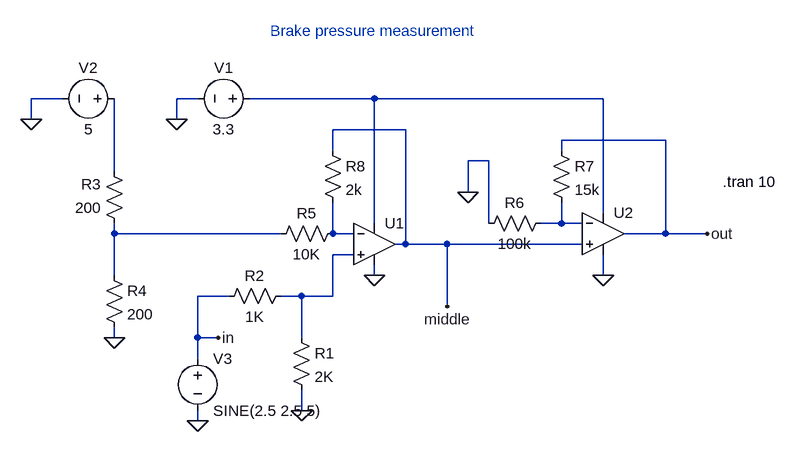
[diagram p0: schematic Brake pressure.asc]
Brake pressure.asc, the LTspice schematic file:
Version 4
SHEET 1 880 680
WIRE -320 -48 -368 -48
WIRE -112 -48 -144 -48
WIRE 160 -48 -32 -48
WIRE 512 -48 160 -48
WIRE -368 -16 -368 -48
WIRE -144 -16 -144 -48
WIRE 208 0 96 0
WIRE 608 16 448 16
WIRE 96 32 96 0
WIRE 448 32 448 16
WIRE 336 48 304 48
WIRE -240 64 -240 -48
WIRE 304 96 304 48
WIRE 512 128 512 -48
WIRE 160 144 160 -48
WIRE 336 144 336 48
WIRE 448 144 448 112
WIRE 448 144 416 144
WIRE 480 144 448 144
WIRE -240 160 -240 144
WIRE 16 160 -240 160
WIRE 96 160 96 112
WIRE 128 160 96 160
WIRE 608 160 608 16
WIRE 608 160 544 160
WIRE 672 160 608 160
WIRE 208 176 208 0
WIRE 208 176 192 176
WIRE 272 176 208 176
WIRE 480 176 272 176
WIRE 128 192 96 192
WIRE -240 224 -240 160
WIRE 160 224 160 208
WIRE 512 224 512 192
WIRE -64 256 -112 256
WIRE 48 256 16 256
WIRE 96 256 96 192
WIRE 96 256 48 256
WIRE 272 272 272 176
WIRE -240 320 -240 304
WIRE -112 320 -112 256
WIRE -80 320 -112 320
WIRE 48 320 48 256
WIRE -112 352 -112 320
WIRE 48 432 48 400
WIRE -112 448 -112 432
FLAG -240 320 0
FLAG 304 96 0
FLAG 48 432 0
FLAG 512 224 0
FLAG 160 224 0
FLAG -144 -16 0
FLAG -368 -16 0
FLAG -112 448 0
FLAG -80 320 in
FLAG 672 160 out
FLAG 272 272 middle
SYMBOL OpAmps\\UniversalOpamp 160 176 R0
SYMATTR InstName U1
SYMBOL OpAmps\\UniversalOpamp 512 160 R0
SYMATTR InstName U2
SYMBOL res 32 304 R0
SYMATTR InstName R1
SYMATTR Value 2K
SYMATTR SpiceLine tol=1 pwr=0.1
SYMBOL res 32 240 R90
WINDOW 0 0 56 VBottom 2
WINDOW 3 32 56 VTop 2
SYMATTR InstName R2
SYMATTR Value 1K
SYMATTR SpiceLine tol=1 pwr=0.1
SYMBOL res -224 160 R180
WINDOW 0 36 76 Left 2
WINDOW 3 36 40 Left 2
SYMATTR InstName R3
SYMATTR Value 200
SYMATTR SpiceLine tol=1 pwr=0.1
SYMBOL res -256 208 R0
SYMATTR InstName R4
SYMATTR Value 200
SYMATTR SpiceLine tol=1 pwr=0.1
SYMBOL res 112 144 R90
WINDOW 0 0 56 VBottom 2
WINDOW 3 32 56 VTop 2
SYMATTR InstName R5
SYMATTR Value 10K
SYMATTR SpiceLine tol=1 pwr=0.1
SYMBOL res 432 128 R90
WINDOW 0 0 56 VBottom 2
WINDOW 3 32 56 VTop 2
SYMATTR InstName R6
SYMATTR Value 100k
SYMATTR SpiceLine tol=1 pwr=0.1
SYMBOL voltage -16 -48 R90
WINDOW 0 -32 56 VBottom 2
WINDOW 3 32 56 VTop 2
WINDOW 123 0 0 Left 0
WINDOW 39 0 0 Left 0
SYMATTR InstName V1
SYMATTR Value 3.3
SYMBOL voltage -224 -48 R90
WINDOW 0 -32 56 VBottom 2
WINDOW 3 32 56 VTop 2
WINDOW 123 0 0 Left 0
WINDOW 39 0 0 Left 0
SYMATTR InstName V2
SYMATTR Value 5
SYMBOL voltage -112 336 R0
WINDOW 123 0 0 Left 0
WINDOW 39 0 0 Left 0
SYMATTR InstName V3
SYMATTR Value SINE(2.5 2.5 5)
SYMBOL res 80 16 R0
SYMATTR InstName R8
SYMATTR Value 2k
SYMBOL res 432 16 R0
SYMATTR InstName R7
SYMATTR Value 15k
TEXT 696 80 Left 2 !.tran 10
TEXT 0 -152 Left 2 ;Brake pressure measurement

The netlist it stands for:
* Brake pressure.asc
XU1 N006 N005 N001 0 middle level1 Avol=1Meg GBW=10Meg Vos=0 En=0 Enk=0 In=0 Ink=0 Rin=500Meg  ; pins In+ In- V+ V- OUT
XU2 middle N003 N001 0 out level1 Avol=1Meg GBW=10Meg Vos=0 En=0 Enk=0 In=0 Ink=0 Rin=500Meg  ; pins In+ In- V+ V- OUT
R1 N006 0 2K tol=1 pwr=0.1
R2 N006 in 1K tol=1 pwr=0.1
R3 N004 N002 200 tol=1 pwr=0.1
R4 N004 0 200 tol=1 pwr=0.1
R5 N005 N004 10K tol=1 pwr=0.1
R6 N003 0 100k tol=1 pwr=0.1
V1 N001 0 3.3
V2 N002 0 5
V3 in 0 SINE(2.5 2.5 5)
R8 middle N005 2k
R7 out N003 15k
.tran 10
* Brake pressure measurement
.lib UniversalOpAmp1.lib
.backanno
.end